# Altium schematic sheet Push Button.SchDoc
size A4; SheetNumber: 5; SheetTotal: 6
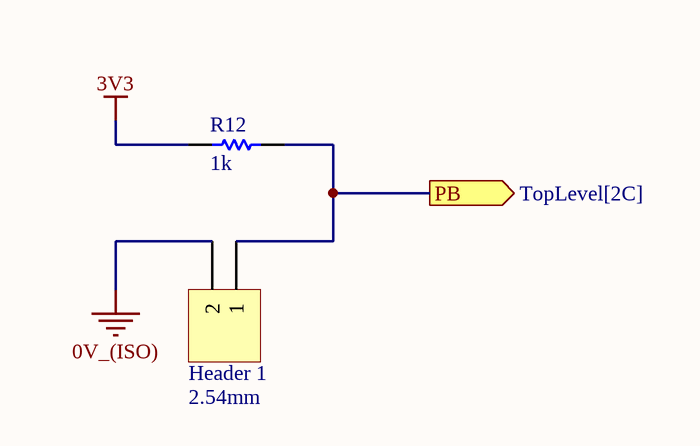
[diagram p0: Push Button.SchDoc]

## Parts
Header_1  2.54mm  [TH 2.54mm Header 1x2]
R12  1k  [0805]

## Ports
PB (out, see TopLevel[2C])

## Nets
0V_(ISO): Header_1.2
3V3: R12.1
PB: Header_1.1 R12.2 ; port PB

## Library data of the parts
Header_1 = TH 2.54mm Header 1x2: Positions: 2; Angle: 0; Flange: No; Contact: NA; Part Number: TH 2.54mm Header 1x2; Pitch: 2.54mm; Row Spacing: 2.54mm
R12 = RC0805FR071KL: Manufacturer: YAGEO; Tolerance: 0.01; Rated Voltage: 0.125W; Part Number: RC0805FR071KL; Value: 1k; Material: FR-07; Digikey Part Number: 311-1.00KCRCT-ND